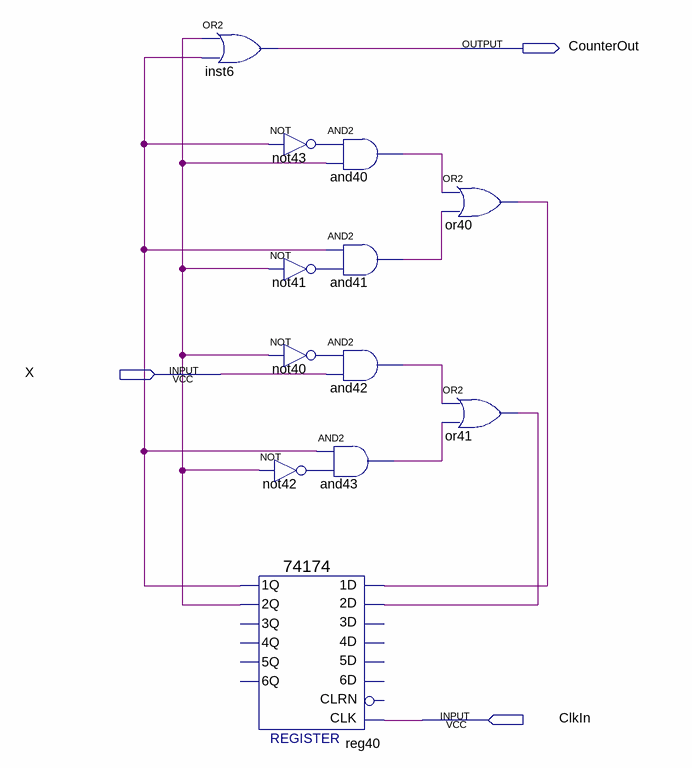
[diagram p0: schematic sheet]
// Quartus schematic counterBout.bdf as structural Verilog: 12 symbols, 3 pins
module counterBout (
  input  X,
  input  ClkIn,
  output CounterOut
);

  wire and40_out, and41_out, and42_out, and43_out, not40_out, not41_out, not42_out, not43_out, or40_out,
       or41_out, reg40_1q, reg40_2q;

  or inst6 (CounterOut, reg40_2q, reg40_1q);
  \74174  reg40 (
    .CLK(ClkIn), .\1D (or40_out), .\2D (or41_out), .\1Q (reg40_1q), .\2Q (reg40_2q));  // open: 4D, 3D, 5D, 6D, CLRN, 4Q, 3Q, 6Q, 5Q
  not not43 (not43_out, reg40_1q);
  not not41 (not41_out, reg40_2q);
  not not40 (not40_out, reg40_2q);
  and and43 (and43_out, reg40_1q, not42_out);
  not not42 (not42_out, reg40_2q);
  and and40 (and40_out, not43_out, reg40_2q);
  and and41 (and41_out, reg40_1q, not41_out);
  and and42 (and42_out, not40_out, X);
  or or40 (or40_out, and40_out, and41_out);
  or or41 (or41_out, and42_out, and43_out);
endmodule
